# EAGLE design attiny1634_bo (EAGLE 6.3)
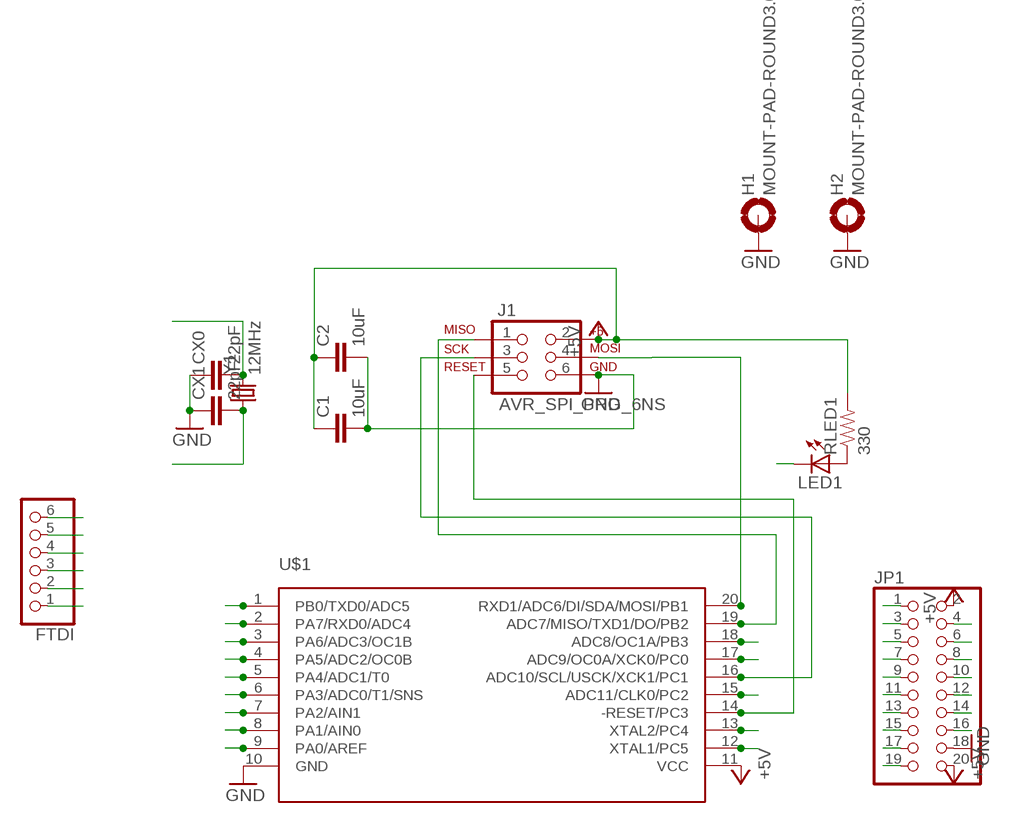
[diagram p0: schematic, sheet 1]

## Parts
C1  10uF  C-EUC0805  [C0805]
C2  10uF  C-EUC0805  [C0805]
CX0  22pF  C-EUC0603  [C0603]
CX1  22pF  C-EUC0603  [C0603]
FTDI  PINHD-1X6  [1X06]
H1  MOUNT-PAD-ROUND3.0  [3,0-PAD]
H2  MOUNT-PAD-ROUND3.0  [3,0-PAD]
J1  AVR_SPI_PRG_6NS  [2X3-NS]
JP1  PINHD-2X10  [2X10]
LED1  LED0603  [LED-0603]
RLED1  330  RESISTOR0603-RES  [0603-RES]
U$1  ATTINY1634  [SOIC20]
Y1  12MHz  CRYSTAL5X3  [CRYSTAL-SMD-5X3]

## Nets
+5V [POWER]: C1.1 C2.1 FTDI.3 J1.2 JP1.2 JP1.20 RLED1.2 U$1.11(VCC)
CTS: FTDI.2
GND [POWER]: C1.2 C2.2 CX0.1 CX1.1 FTDI.1 H1.B3,0(MOUNT) H2.B3,0(MOUNT) J1.6 JP1.18 U$1.10(GND)
N$1: LED1.A RLED1.1
PA0: JP1.5 U$1.9(PA0/AREF)
PA1: JP1.7 U$1.8(PA1/AIN0)
PA2: JP1.9 U$1.7(PA2/AIN1)
PA3: JP1.11 U$1.6(PA3/ADC0/T1/SNS)
PA4: JP1.13 U$1.5(PA4/ADC1/T0)
PA5: JP1.15 U$1.4(PA5/ADC2/OC0B)
PA6: JP1.17 U$1.3(PA6/ADC3/OC1B)
PA7/RX0: FTDI.4 JP1.19 U$1.2(PA7/RXD0/ADC4)
PB0/TXD0: FTDI.5 JP1.16 U$1.1(PB0/TXD0/ADC5)
PB1/MOSI/ADC6: J1.4 JP1.14 U$1.20(RXD1/ADC6/DI/SDA/MOSI/PB1)
PB2/ADC7/TX1: J1.1 JP1.12 U$1.19(ADC7/MISO/TXD1/DO/PB2)
PB3/ADC8/OC1A: JP1.10 U$1.18(ADC8/OC1A/PB3)
PC0/ADC9/OC0A: JP1.8 LED1.C U$1.17(ADC9/OC0A/XCK0/PC0)
PC1/SCL/ADC10: J1.3 JP1.1 U$1.16(ADC10/SCL/USCK/XCK1/PC1)
PC2/ADC11: JP1.3 U$1.15(ADC11/CLK0/PC2)
PC3/-RESET: FTDI.6 J1.5 U$1.14(-RESET/PC3)
PC4/XTAL2: CX0.2 JP1.6 U$1.13(XTAL2/PC4) Y1.3
PC5/XTAL1: CX1.2 JP1.4 U$1.12(XTAL1/PC5) Y1.1

## Library data of the parts
C1 C2 CX0 CX1 = rcl:C-EU: CAPACITOR, European symbol
FTDI = pinhead:PINHD-1X6: PIN HEADER
H1 H2 = holes:MOUNT-PAD-ROUND: MOUNTING PAD, round
J1 = SparkFun-Connectors:AVR_SPI_PRG_6: AVR ISP 6 Pin This is the reduced ISP connector for AVR programming. Common on Arduino. This footprint will take up less PCB space and can be used with a 10-pin to 6-pin adapter such as SKU: BOB-08508
JP1 = pinhead:PINHD-2X10: PIN HEADER
LED1 = SparkFun-LED:LED: LEDs Standard schematic elements and footprints for 5mm, 3mm, 1206, and 0603 sized LEDs. 5mm - Spark Fun Electronics SKU : COM-00529 (and others)
RLED1 = SparkFun-Passives:RESISTOR: Resistor Basic schematic elements and footprints for 0603, 1206, and PTH resistors.
U$1 = attiny1634:ATTINY1634
Y1 = SparkFun-FreqCtrl:CRYSTAL: Various standard crystals. Proven footprints. Spark Fun Electronics SKU : COM-00534

## Net classes
1 POWER: width 0.254 mm

## Board
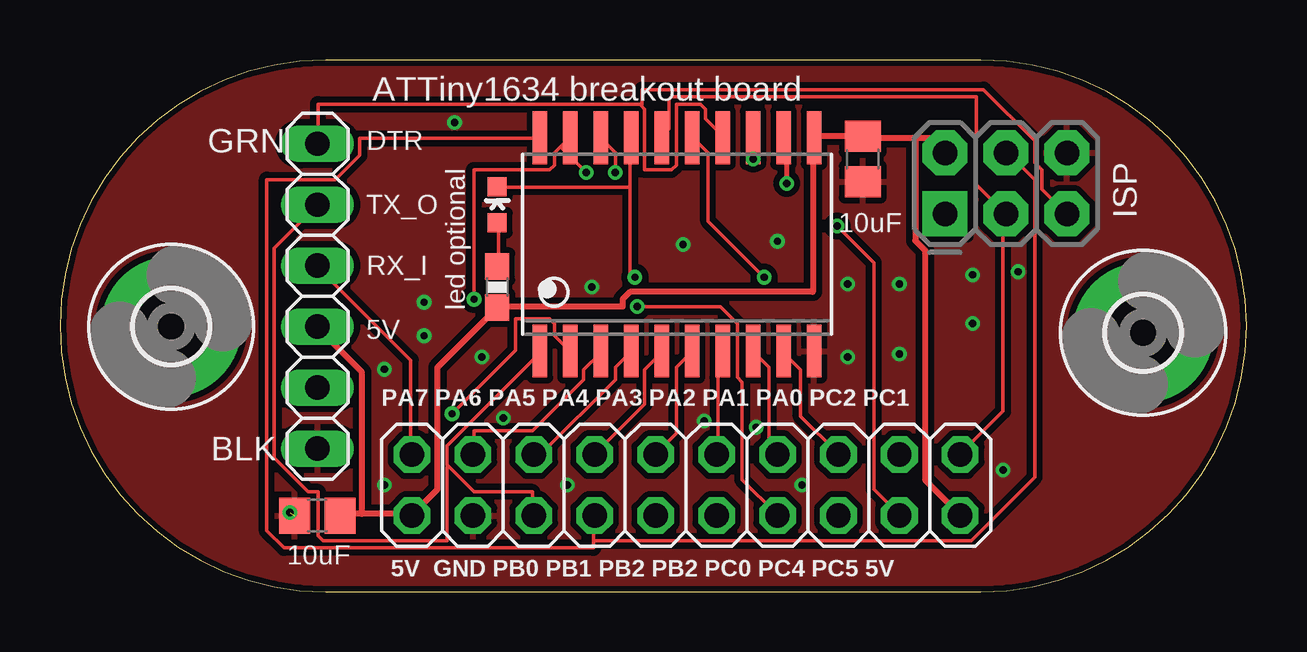
[diagram p1: board, top side]
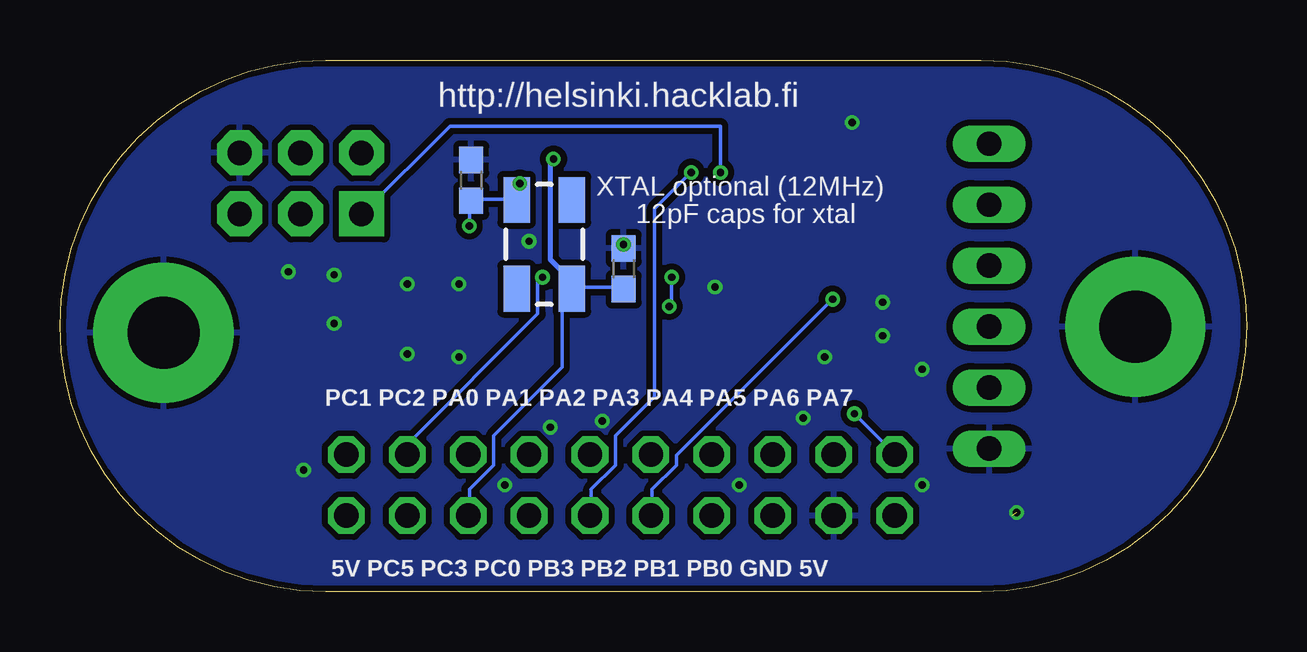
[diagram p2: board, bottom side, seen from below]

Size 49.46 x 22.16 mm. Coordinates in mm from the lower left corner, seen from the top.
Outline: 11.08,22.16 arc180 11.08,0 38.38,0 arc180 38.38,22.16 11.08,22.16
Copper layers (1*16): Top 0.035mm / dielectric 1.5mm / Bottom 0.035mm
Design rules "default": minimum track width 6mil, minimum drill 12mil, track to track 6mil, track to pad 6mil, pad to pad 6mil, via to via 6mil, smd to smd 0mil, copper to edge 10mil, drill to drill 10mil, minimum pad ring 10mil, minimum via ring 6mil, stop-mask expansion 2mil, vias tented up to drill 100mil, thermal gap 10mil

### Footprints (pad centres in the part's own frame; a part is rotated, then mirrored left to right if it is on the bottom)
C0805 = smd 1.3 x 1.5: 1 -0.95,0; 2 0.95,0
C0603 = smd 1.1 x 1: 1 -0.85,0; 2 0.85,0
1X06 = drill 1.016 long: 1 -6.35,0; 2 -3.81,0; 3 -1.27,0; 4 1.27,0; 5 3.81,0; 6 6.35,0
3,0-PAD = drill 3 pad 5.842: B3,0 0,0
2X3-NS = drill 1.016 pad 1.88 square: 1 -2.54,-1.27 | drill 1.016 pad 1.88 octagon: 2 -2.54,1.27; 3 0,-1.27; 4 0,1.27; 5 2.54,-1.27; 6 2.54,1.27
2X10 = drill 1.016 octagon: 1 -11.43,-1.27; 2 -11.43,1.27; 3 -8.89,-1.27; 4 -8.89,1.27; 5 -6.35,-1.27; 6 -6.35,1.27; 7 -3.81,-1.27; 8 -3.81,1.27; 9 -1.27,-1.27; 10 -1.27,1.27; 11 1.27,-1.27; 12 1.27,1.27; 13 3.81,-1.27; 14 3.81,1.27; 15 6.35,-1.27; 16 6.35,1.27; 17 8.89,-1.27; 18 8.89,1.27; 19 11.43,-1.27; 20 11.43,1.27
LED-0603 = smd 0.8 x 0.8: A 0,-0.75; C 0,0.75
0603-RES = smd 1.1 x 1: 1 -0.85,0; 2 0.85,0
SOIC20 = smd 0.6 x 2.2: 1 -1.905,-4.445; 2 -0.635,-4.445; 3 0.635,-4.445; 4 1.905,-4.445; 5 3.175,-4.445; 6 4.445,-4.445; 7 5.715,-4.445; 8 6.985,-4.445; 9 8.255,-4.445; 10 9.525,-4.445; 11 9.525,4.445; 12 8.255,4.445; 13 6.985,4.445; 14 5.715,4.445; 15 4.445,4.445; 16 3.175,4.445; 17 1.905,4.445; 18 0.635,4.445; 19 -0.635,4.445; 20 -1.905,4.445
CRYSTAL-SMD-5X3 = smd 1.9 x 1.1: 1 -1.85,-1.15; 2 1.85,-1.15; 3 1.85,1.15; 4 -1.85,1.15

### Placement (x,y rotation side)
C1  33.46,18.03 270 top
C2  10.73,3.17 180 top
CX0  25.97,13.46 270 bottom
CX1  32.32,17.14 270 bottom
FTDI  10.73,12.32 90 top
H1  4.64,11.05 0 top
H2  45.15,10.79 0 top
J1  39.43,17.02 0 top
JP1  26.1,4.45 180 top
LED1  18.22,16.13 0 top
RLED1  18.22,12.7 270 top
U$1  21.91,14.48 0 top
Y1  29.27,14.48 270 bottom

### Tracks (layer width: path | path; a pad name or v marks a point on that pad's centre or on a via)
+5V
  Top 0.254: 12.59,3.25 14.62,3.25 JP1.20 14.72,3.25 15.74,4.27 15.74,9.35 18.17,11.79 RLED1.2 18.28,11.89 23.46,11.89 23.46,12.19 23.76,12.5 31.38,12.5 31.38,18.9 U$1.11 31.48,19 33.41,19 C1.1 33.52,18.9 35.65,18.9 | 12.59,3.25 11.77,3.25 C2.1 | FTDI.3 10.76,10.97 12.59,9.14 12.59,3.35 12.59,3.25 | 35.65,18.9 36.87,18.9 36.87,18.29 J1.2 | JP1.2 37.48,3.25 36.06,4.67 36.06,14.22 35.65,14.63 35.65,18.8 35.65,18.9
GND  (via drill 0.3)  (1 unrouted)
  other vias: 38.04,11.18 34.99,12.83 38.04,13.21 39.31,5.08 39.94,13.34 34.99,9.91 32.83,12.83 32.83,9.78 26.86,7.11 29.02,6.86 30.92,4.45 21.15,4.45 18.48,7.24 22.16,12.7 25.97,14.48 15.18,10.67 15.18,12.06 17.59,9.78 29.91,14.61 13.53,9.27 13.53,4.45 9.59,3.3 16.45,19.56
  pour Top (isolate 0.254): -0.32,22.1 -0.32,0 49.85,0 49.72,22.1
  pour Bottom (isolate 0.254): -0.32,22.1 -0.32,0 50.1,-0.13 49.72,22.1
N$1
  Top 0.152: LED1.A 18.28,15.34 18.28,13.61 RLED1.1
PA0
  Top 0.152: U$1.9 30.16,9.96 30.87,9.25 30.87,7.32 32.4,5.79 JP1.5
PA1
  Top 0.152: U$1.8 28.94,9.96 29.55,9.35 29.55,6.1 29.86,5.79 JP1.7
PA2
  Top 0.152: U$1.7 27.62,9.96 27.42,9.75 27.42,5.79 JP1.9
PA3
  Top 0.152: U$1.6 26.3,9.96 25.69,9.35 25.69,6.6 24.88,5.79 JP1.11
PA4
  Top 0.152: U$1.5 25.08,9.96 24.37,9.25 24.37,7.82 22.34,5.79 JP1.13
PA5
  Top 0.152: U$1.4 23.76,9.96 23.15,9.35 23.15,8.84 20.1,5.79 19.8,5.79 JP1.15
PA6
  Top 0.152: U$1.3 22.54,9.96 21.83,9.25 21.83,8.84 19.7,6.71 17.26,6.71 17.26,5.79 JP1.17
PA7/RX0  (via drill 0.3)
  Top 0.152: v16.34,7.42 18.99,10.06 18.99,11.38 20.41,11.38 20.61,11.18 20.61,10.67 21.22,10.06 U$1.2 | FTDI.4 10.76,13.51 14.62,9.65 14.62,5.79 JP1.19
  Bottom 0.152: v16.34,7.42 14.72,5.79 JP1.19
PB0/TXD0
  Top 0.152: 16.19,5.23 17.26,4.17 19.7,4.17 19.7,3.25 JP1.16 | 16.19,5.23 16.14,5.28 16.14,6.1 20,9.96 U$1.1 | FTDI.5 10.66,16.05 8.93,14.33 8.93,5.59 10.35,4.17 10.76,4.17 10.76,2.34 10.96,2.13 16.14,2.13 16.14,5.18 16.19,5.23
PB1/MOSI/ADC6
  Top 0.152: 22.24,2.13 22.24,3.15 JP1.14 | 22.24,2.13 22.24,1.83 9.33,1.83 8.62,2.54 8.62,17.17 11.47,17.17 12.48,18.19 12.48,18.9 20,18.9 U$1.20 | 22.24,2.13 37.99,2.13 40.63,4.78 40.63,17.17 39.51,18.29 J1.4
PB2/ADC7/TX1  (via drill 0.3)
  Top 0.152: 20.87,18.54 20.61,18.29 20.61,17.78 20.41,17.58 17.26,17.58 v17.26,12.19 | 20.87,18.54 21.22,18.9 U$1.19 | v21.93,17.48 20.92,18.49 20.87,18.54
  Bottom 0.152: v17.26,12.19 23.76,5.69 23.76,5.28 24.78,4.27 24.78,3.25 JP1.12 | v21.93,17.48 21.93,19.41 33.21,19.41 36.87,15.75 J1.1
PB3/ADC8/OC1A  (via drill 0.3)
  Top 0.152: v23.15,17.48 23.15,18.29 22.54,18.9 U$1.18
  Bottom 0.152: v23.15,17.48 24.68,15.95 24.68,8.13 26.3,6.5 26.3,5.28 27.32,4.27 27.32,3.25 JP1.10
PC0/ADC9/OC0A  (via drill 0.3)
  Top 0.152: 23.76,16.87 18.28,16.87 LED1.C | 23.76,16.87 23.76,18.9 U$1.17 | v24.07,11.89 27.52,11.89 28.23,11.18 28.23,8.94 28.44,8.74 28.44,4.67 29.86,3.25 JP1.8 | v23.96,13.11 23.76,13.31 23.76,16.87
  Bottom 0.152: v24.07,11.89 23.96,11.99 v23.96,13.11
PC1/SCL/ADC10
  Top 0.152: U$1.16 25.08,19 25.39,19.3 25.39,20.52 25.49,20.62 38.19,20.62 38.19,16.97 39.41,15.75 J1.3 39.31,15.75 39.31,7.52 37.58,5.79 JP1.1
PC2/ADC11  (via drill 0.3)
  Top 0.152: v29.35,13.11 27.01,15.44 27.01,18.29 26.4,18.9 U$1.15
  Bottom 0.152: v29.35,13.11 29.55,12.9 29.55,11.58 34.94,6.2 34.94,5.79 JP1.3
PC3/-RESET
  Top 0.152: 24.22,20.27 24.17,20.32 10.76,20.32 10.76,18.69 FTDI.6 | 24.22,20.27 24.37,20.12 24.37,17.58 25.49,17.58 25.69,17.78 25.69,20.32 26.71,20.32 26.91,20.12 26.91,19.71 27.62,19 U$1.14 | J1.5 41.95,15.75 40.93,16.76 40.93,17.58 40.63,17.88 40.63,18.8 38.49,20.93 24.27,20.93 24.27,20.32 24.22,20.27
PC4/XTAL2  (via drill 0.3)
  Top 0.203: v28.89,18.03 U$1.13
  Bottom 0.152: CX0.2 26,12.7 28.03,12.7 Y1.3 28.13,12.6 28.54,12.19 28.54,9.35 31.38,6.5 31.38,5.28 32.4,4.27 32.4,3.25 JP1.6
  Bottom 0.203: Y1.3 28.12,12.95 29.02,13.84 29.02,17.91 v28.89,18.03
PC5/XTAL1  (via drill 0.3)
  Top 0.152: v32.4,15.24 33.92,13.72 33.92,4.27 34.94,3.25 JP1.4
  Top 0.203: U$1.12 30.16,18.03 30.29,17.91 v30.29,17.02
  Bottom 0.152: Y1.1 30.47,16.36 32.3,16.36 CX1.2 32.4,16.26 v32.4,15.24
  Bottom 0.203: v30.29,17.02 30.29,16.46 Y1.1

### Text on the board
tNames: ATTiny1634 breakout board | GRN | DTR | led optional | ISP | TX_O | 10uF | RX_I | 5V | PA7 PA6 PA5 PA4 PA3 PA2 PA1 PA0 PC2 PC1 | BLK | 10uF | 5V GND PB0 PB1 PB2 PB2 PC0 PC4 PC5 5V
bNames: http://helsinki.hacklab.fi | XTAL optional (12MHz) | 12pF caps for xtal | PC1 PC2 PA0 PA1 PA2 PA3 PA4 PA5 PA6 PA7 | 5V PC5 PC3 PC0 PB3 PB2 PB1 PB0 GND 5V